# Altium schematic sheet MAGI'sCM0Core.SchDoc
size A4
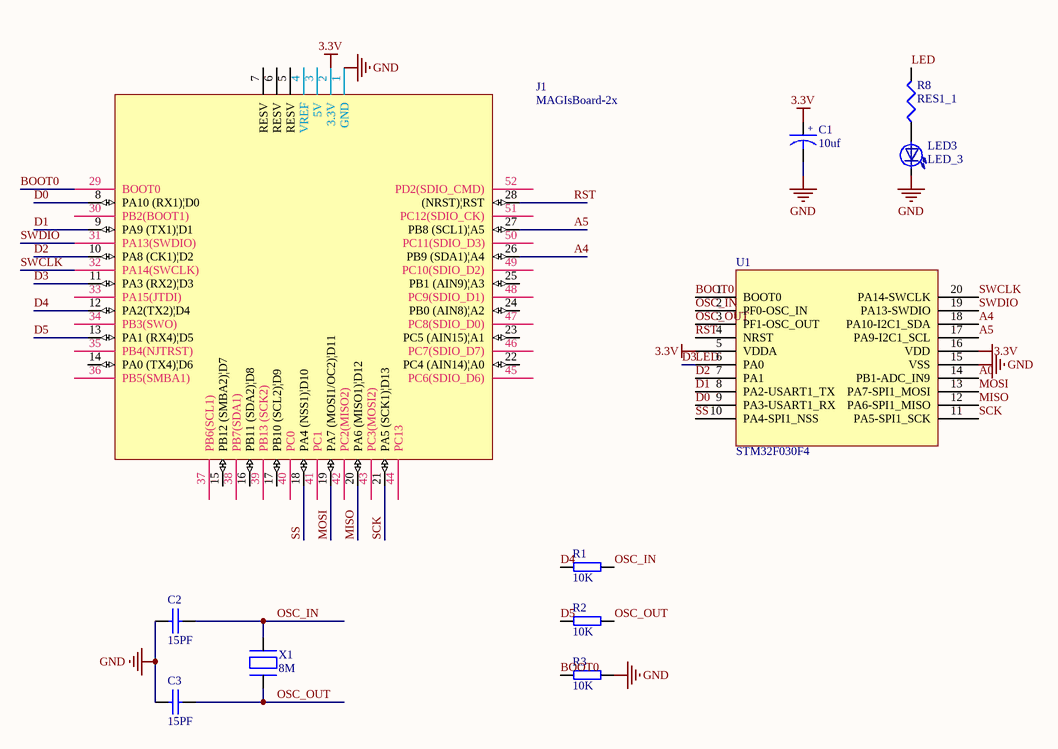
[diagram p0: MAGI'sCM0Core.SchDoc]

## Parts
C1  10uf  [6-0805_n]
C2  15PF  [6-0805_n]
C3  15PF  [6-0805_n]
J1  MAGIsBoard-2x  [MAGIsBoard-2x]
LED3  LED_3  [6-0805_N]
R1  10K  [6-0805_n]
R2  10K  [6-0805_n]
R3  10K  [6-0805_n]
R8  RES1_1  [6-0805_N]
U1  STM32F030F4  [STM32F030]
X1  8M  [5032]

## Nets
3.3V: C1.1 J1.2(3.3V) U1.5(VDDA) U1.16(VDD)
GND: C1.2 C2.1 C3.1 J1.1(GND) LED3.2(K) R3.1 U1.15(VSS)
A0: U1.14(PB1-ADC_IN9)
A4: J1.26(PB9_(SDA1)|A4) U1.18(PA10-I2C1_SDA)
A5: J1.27(PB8_(SCL1)|A5) U1.17(PA9-I2C1_SCL)
BOOT0: J1.29(BOOT0) R3.2 U1.1(BOOT0)
D0: J1.8(PA10_(RX1)|D0) U1.9(PA3-USART1_RX)
D1: J1.9(PA9_(TX1)|D1) U1.8(PA2-USART1_TX)
D2: J1.10(PA8_(CK1)|D2) U1.7(PA1)
D3: J1.11(PA3_(RX2)|D3) R8.2 U1.6(PA0)  [also labelled LED]
D4: J1.12(PA2(TX2)|D4) R1.2
D5: J1.13(PA1_(RX4)|D5) R2.2
MISO: J1.20(PA6_(MISO1)|D12) U1.12(PA6-SPI1_MISO)
MOSI: J1.19(PA7_(MOSI1/OC2)|D11) U1.13(PA7-SPI1_MOSI)
OSC_IN: C2.2 R1.1 U1.2(PF0-OSC_IN) X1.1
OSC_OUT: C3.2 R2.1 U1.3(PF1-OSC_OUT) X1.2
RST: J1.28((NRST)|RST) U1.4(NRST)
SCK: J1.21(PA5_(SCK1)|D13) U1.11(PA5-SPI1_SCK)
SS: J1.18(PA4_(NSS1)|D10) U1.10(PA4-SPI1_NSS)
SWCLK: J1.32(PA14(SWCLK)) U1.20(PA14-SWCLK)
SWDIO: J1.31(PA13(SWDIO)) U1.19(PA13-SWDIO)
NetLED3_1: LED3.1(A) R8.1

Not connected (* = marked no-connect by the designer): J1 3(5V) 4(VREF) 5(RESV) 6(RESV) 7(RESV) 14(PA0_(TX4)|D6) 15(PB12_(SMBA2)|D7) 16(PB11_(SDA2)|D8) 17(PB10_(SCL2)|D9) 22(PC4_(AIN14)|A0) 23(PC5_(AIN15)|A1) 24(PB0_(AIN8)|A2) 25(PB1_(AIN9)|A3) 30(PB2(BOOT1)) 33(PA15(JTDI)) 34(PB3(SWO)) 35(PB4(NJTRST)) 36(PB5(SMBA1)) 37(PB6(SCL1)) 38(PB7(SDA1)) 39(PB13_(SCK2)) 40(PC0) 41(PC1) 42(PC2(MISO2)) 43(PC3(MOSI2)) 44(PC13) 45(PC6(SDIO_D6)) 46(PC7(SDIO_D7)) 47(PC8(SDIO_D0)) 48(PC9(SDIO_D1)) 49(PC10(SDIO_D2)) 50(PC11(SDIO_D3)) 51(PC12(SDIO_CK)) 52(PD2(SDIO_CMD))

## Notes on the sheet
- (in symbol CAPACITOR POL) +

## Library data of the parts
C1 = CAPACITOR POL: Capacitor
C2 C3 = CAP
R1-R3 = RES
X1 = CRYSTAL